# Altium project k210.PrjPcb
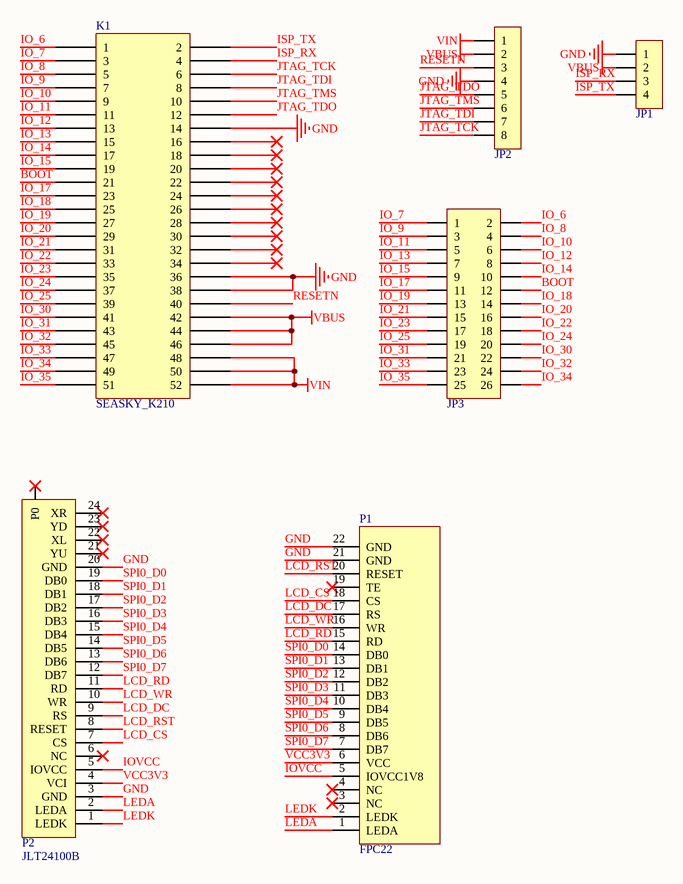
[diagram p0: k210.SchDoc]
1 sheet, 6 parts. Net scope: global (net labels, ports and power ports of the same name join across sheets).
Board file: k210.PcbDoc

## Sheet k210.SchDoc
size A4

### Parts
JP1  HDR-1X4  [MX 1.25-WS-4P]  (value not drawn)
JP2  HDR-1X8  [MX 1.25-WS-8P]  (value not drawn)
JP3  Header 2X11  [HDR2.54-LI-2x13P]  (value not drawn)
K1  SEASKY_K210  [SEASKY_K210]
P1  FPC22  [FPC0.5 2H-WS-22P]
P2  JLT24100B  [FFC/SM0.5-2H24-LCD]

### Nets
GND: JP1.1 JP2.4 K1.14 K1.36 K1.38 P1.21(GND) P1.22(GND) P2.3(GND) P2.20(GND)
VBUS: JP1.2 JP2.2 K1.42 K1.44 K1.46
VIN: JP2.1 K1.48 K1.50 K1.52
BOOT: JP3.12 K1.21
IO_6: JP3.2 K1.1
IO_7: JP3.1 K1.3
IO_8: JP3.4 K1.5
IO_9: JP3.3 K1.7
IO_10: JP3.6 K1.9
IO_11: JP3.5 K1.11
IO_12: JP3.8 K1.13
IO_13: JP3.7 K1.15
IO_14: JP3.10 K1.17
IO_15: JP3.9 K1.19
IO_17: JP3.11 K1.23
IO_18: JP3.14 K1.25
IO_19: JP3.13 K1.27
IO_20: JP3.16 K1.29
IO_21: JP3.15 K1.31
IO_22: JP3.18 K1.33
IO_23: JP3.17 K1.35
IO_24: JP3.20 K1.37
IO_25: JP3.19 K1.39
IO_30: JP3.22 K1.41
IO_31: JP3.21 K1.43
IO_32: JP3.24 K1.45
IO_33: JP3.23 K1.47
IO_34: JP3.26 K1.49
IO_35: JP3.25 K1.51
IOVCC: P1.5(IOVCC1V8) P2.5(IOVCC)
ISP_RX: JP1.3 K1.4
ISP_TX: JP1.4 K1.2
JTAG_TCK: JP2.8 K1.6
JTAG_TDI: JP2.7 K1.8
JTAG_TDO: JP2.5 K1.12
JTAG_TMS: JP2.6 K1.10
LCD_CS: P1.18(CS) P2.7(CS)
LCD_DC: P1.17(RS) P2.9(RS)
LCD_RD: P1.15(RD) P2.11(RD)
LCD_RST: P1.20(RESET) P2.8(RESET)
LCD_WR: P1.16(WR) P2.10(WR)
LEDA: P1.1(LEDA) P2.2(LEDA)
LEDK: P1.2(LEDK) P2.1(LEDK)
RESETN: JP2.3 K1.40
SPI0_D0: P1.14(DB0) P2.19(DB0)
SPI0_D1: P1.13(DB1) P2.18(DB1)
SPI0_D2: P1.12(DB2) P2.17(DB2)
SPI0_D3: P1.11(DB3) P2.16(DB3)
SPI0_D4: P1.10(DB4) P2.15(DB4)
SPI0_D5: P1.9(DB5) P2.14(DB5)
SPI0_D6: P1.8(DB6) P2.13(DB6)
SPI0_D7: P1.7(DB7) P2.12(DB7)
VCC3V3: P1.6(VCC) P2.4(VCI)

Not connected (* = marked no-connect by the designer): K1 16* 18* 20* 22* 24* 26* 28* 30* 32* 34*; P1 3(NC)* 4(NC)* 19(TE)*; P2 6(NC)* 21(YU)* 22(XL)* 23(YD)* 24(XR)* P0*

### Library data of the parts
JP1 = Header 4: 4P接插件
JP2 = Header 8: 8P接插件
JP3 = Header 13X2: 13*2P接插件
K1 = SEASKY_K210: mini-PCI-E
P2 = JLT24100B: LatestRevisionDate: 17-Jul-2002; LatestRevisionNote: Re-released for DXP Platform.; Publisher: Altium Limited